# Altium schematic sheet Impedance converter.SchDoc
size A4; CompanyName: Technische Hochschule Nürnberg Georg Simon Ohm; Organization: UltraZohm; Address1: Kesslerplatz 12; Address2: 90489 Nürnberg; Address3: GERMANY; DocumentNumber: 12; SheetNumber: 12; SheetTotal: 12; Website: www.ultrazohm.com
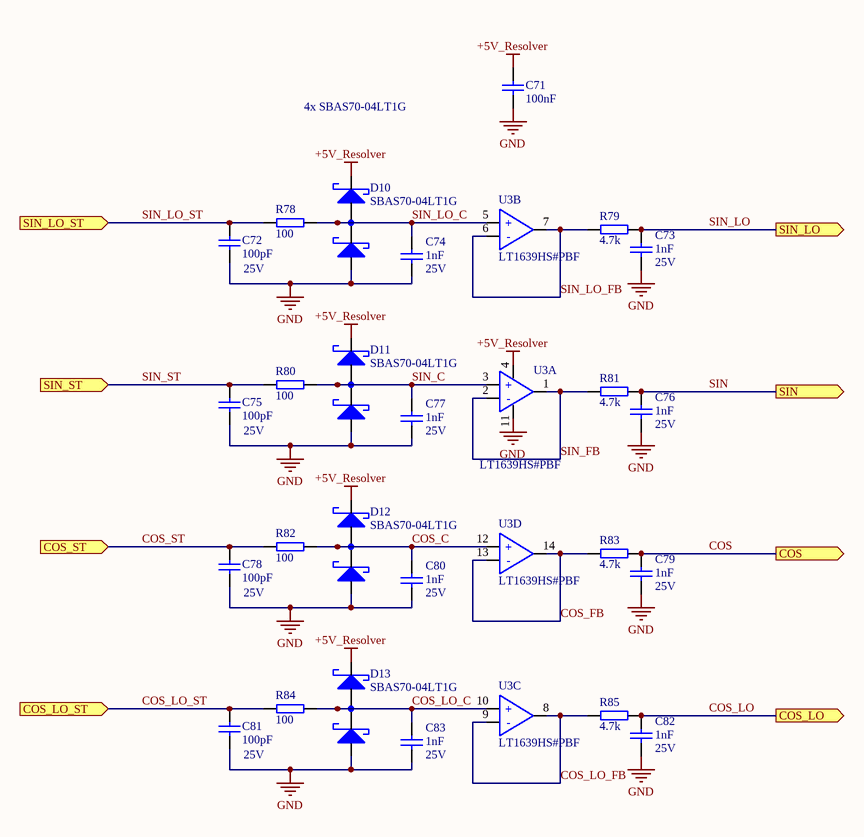
[diagram p0: Impedance converter.SchDoc]

## Parts
C71  100nF  [CAPC1608X07N]
C72  100pF  Voltage: 25V  [CAPC1608X07N]
C73  1nF  Voltage: 25V  [CAPC1608X07N]
C74  1nF  Voltage: 25V  [CAPC1608X07N]
C75  100pF  Voltage: 25V  [CAPC1608X07N]
C76  1nF  Voltage: 25V  [CAPC1608X07N]
C77  1nF  Voltage: 25V  [CAPC1608X07N]
C78  100pF  Voltage: 25V  [CAPC1608X07N]
C79  1nF  Voltage: 25V  [CAPC1608X07N]
C80  1nF  Voltage: 25V  [CAPC1608X07N]
C81  100pF  Voltage: 25V  [CAPC1608X07N]
C82  1nF  Voltage: 25V  [CAPC1608X07N]
C83  1nF  Voltage: 25V  [CAPC1608X07N]
D10  SBAS70-04LT1G  [SOT-23]
D11  SBAS70-04LT1G  [SOT-23]
D12  SBAS70-04LT1G  [SOT-23]
D13  SBAS70-04LT1G  [SOT-23]
R78  100  [RESC1608X06N]
R79  4.7k  [RESC1608X06N]
R80  100  [RESC1608X06N]
R81  4.7k  [RESC1608X06N]
R82  100  [RESC1608X06N]
R83  4.7k  [RESC1608X06N]
R84  100  [RESC1608X06N]
R85  4.7k  [RESC1608X06N]
U3  LT1639HS#PBF  [SOIC-14]  (parts A,B,C,D of 4)

## Ports
COS (out), COS_LO (out), COS_LO_ST (in), COS_ST (in), SIN (out), SIN_LO (out), SIN_LO_ST (in), SIN_ST (in)

## Nets
+5V_Resolver: C71.1 D10.2 D11.2 D12.2 D13.2 U3.4(V+)
GND: C71.2 C72.2 C73.2 C74.2 C75.2 C76.2 C77.2 C78.2 C79.2 C80.2 C81.2 C82.2 C83.2 D10.1 D11.1 D12.1 D13.1 U3.11(V-)
COS: C79.1 R83.2 ; port COS
COS_C: C80.1 D12.3 R82.2 U3.12(+)
COS_FB: R83.1 U3.13(-) U3.14
COS_LO: C82.1 R85.2 ; port COS_LO
COS_LO_C: C83.1 D13.3 R84.2 U3.10(+)
COS_LO_FB: R85.1 U3.8 U3.9(-)
COS_LO_ST: C81.1 R84.1 ; port COS_LO_ST
COS_ST: C78.1 R82.1 ; port COS_ST
SIN: C76.1 R81.2 ; port SIN
SIN_C: C77.1 D11.3 R80.2 U3.3(+)
SIN_FB: R81.1 U3.1 U3.2(-)
SIN_LO: C73.1 R79.2 ; port SIN_LO
SIN_LO_C: C74.1 D10.3 R78.2 U3.5(+)
SIN_LO_FB: R79.1 U3.6(-) U3.7
SIN_LO_ST: C72.1 R78.1 ; port SIN_LO_ST
SIN_ST: C75.1 R80.1 ; port SIN_ST

## Notes on the sheet
- 4x SBAS70-04LT1G
- Title
- Revision:
- Design Engineer:
- Date:
- Project:
- Sheet
- of

## Library data of the parts
C71 = Cap_0603: MPN: 885012206071; MF: Würth; Voltage: 25V; Value: 100nF; Supplier 1: Mouser; Supplier 2: *; Supplier Part Number 1: 710-885012206071; Supplier Part Number 2: *
C72-C83 = Cap_0603: MF: *; MPN: *; Supplier 1: *; Supplier 2: *; Supplier Part Number 1: *; Supplier Part Number 2: *
  C72 C75 C78 C81: Value: 100pF
  C73 C74 C76 C77 C79 C80 C82 C83: Value: 1nF
D10-D13 = Diode Array Schottky: DIODE SCHOTTKY 70V DUAL SOT23; MF: ON Semiconductor; Supplier Part Number 2: SBAS70-04LT1GOSCT-ND; MPN: SBAS70-04LT1G; Supplier Part Number 1: 863-SBAS70-04LT1G; Package: SOT-23-3; Supplier 1: Mouser; Supplier 2: Digi-Key
R78-R85 = R_0603: MF: *; MPN: *; Supplier 1: *; Supplier Part Number 1: *
  R78 R80 R82 R84: Value: 100
  R79 R81 R83 R85: Value: 4.7k
U3 = LT1639: IC OPAMP GP 4 CIRCUIT 14SO; MF: Analog Devices; Supplier Part Number 2: LT1639HS#PBF-ND; MPN: LT1639HS#PBF; Supplier Part Number 1: 584-LT1639HS#PBF; Package: SO-14; Supplier 1: Mouser; Supplier 2: Digikey